# Altium project Soldeerbout_PCB.PrjPcb
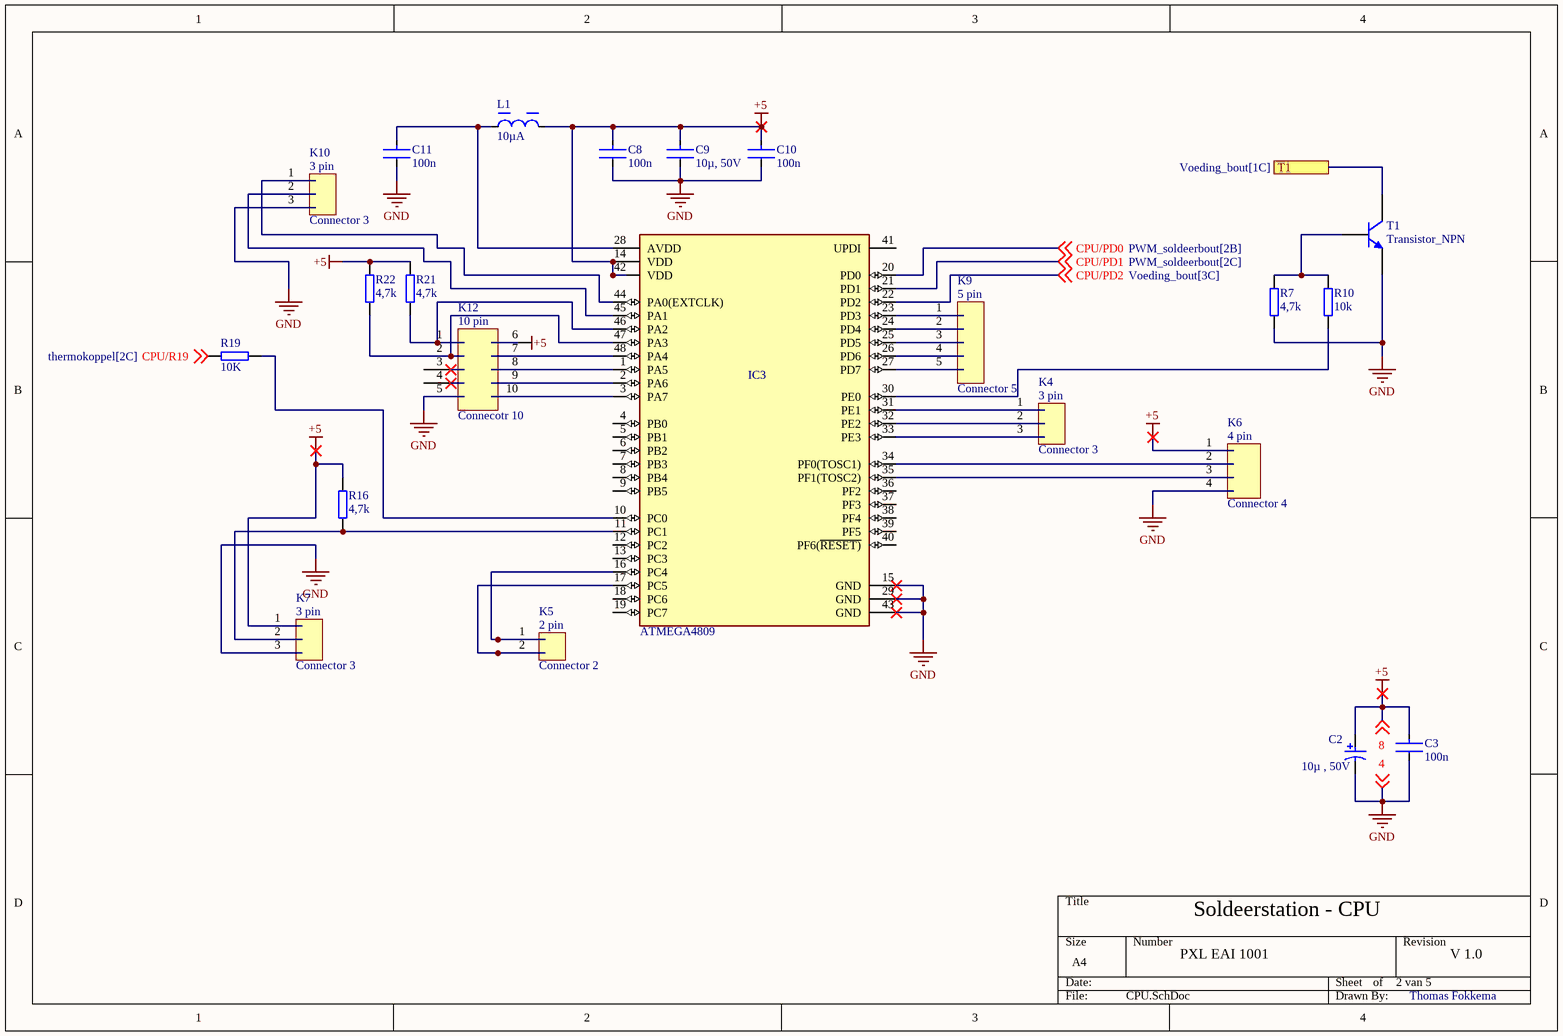
[diagram p0: CPU.SchDoc]
4 sheets, 60 parts. Net scope: flat (ports and power ports of the same name join across sheets).
Board file: PCB1.PcbDoc
Sheets:
  CPU.SchDoc
  thermokoppel.SchDoc
  Voeding_bout.SchDoc
  PWM_soldeerbout.SchDoc

## Sheet CPU.SchDoc
size A4; Address1: PXL EAI 1001; Revision: V 1.0; SheetNumber: 2; SheetTotal: 5; Sheet: 2 van 5

### Parts
C2  10µ , 50V  [CE_D8_L10]
C3  100n  [CC_0805_L]
C8  100n  [CC_0805_L]
C9  10µ, 50V  [CC_0805_L]
C10  100n  [CC_0805_L]
C11  100n  [CC_0805_L]
IC3  ATMEGA4809  [TQFP_48_M]
K4  Connector 3  [HDR1X3]
K5  Connector 2  [HDR1X2]
K6  Connector 4  [HDR1X4]
K7  Connector 3  [HDR1X3]
K9  Connector 5  [HDR1X5]
K10  Connector 3  [HDR1X3]
K12  Connecotr 10  [HDR2X5]
L1  10µA  [CC_0805_L]
R7  4,7k  [R_0805_M]
R10  10k  [R_0805_M]
R16  4,7k  [R_0805_M]
R19  10K  [R_0805_M]
R21  4,7k  [R_0805_M]
R22  4,7k  [R_0805_M]
T1  Transistor_NPN  [SOT_23]

### Ports
T1 (see Voeding_bout[1C])

### Nets
+5: C2.2 C3.1 C8.1 C9.1 C10.1 IC3.14(VDD) IC3.42(VDD) K6.1 K7.1 K12.6 L1.2 R16.2 R21.2 R22.2 ; off-sheet 8  [also labelled 8]
GND: C2.1 C3.2 C8.2 C9.2 C10.2 C11.2 IC3.15(GND) IC3.29(GND) IC3.43(GND) K6.4 K7.3 K10.3 K12.5 R7.1 T1.3(E) ; off-sheet 4  [also labelled 4]
CPU/PD0: IC3.20(PD0) ; off-sheet CPU/PD0
CPU/PD1: IC3.21(PD1) ; off-sheet CPU/PD1
CPU/PD2: IC3.22(PD2) ; off-sheet CPU/PD2
CPU/R19: R19.1 ; off-sheet CPU/R19
NetC11_1: C11.1 IC3.28(AVDD) L1.1
NetD1_2: T1.1(C) ; port T1
NetIC3_1: IC3.1(PA5) K12.8
NetIC3_2: IC3.2(PA6) K12.9
NetIC3_3: IC3.3(PA7) K12.10
NetIC3_10: IC3.10(PC0) R19.2
NetIC3_11: IC3.11(PC1) K7.2 R16.1
NetIC3_16: IC3.16(PC4) K5.1
NetIC3_17: IC3.17(PC5) K5.2
NetIC3_23: IC3.23(PD3) K9.1
NetIC3_24: IC3.24(PD4) K9.2
NetIC3_25: IC3.25(PD5) K9.3
NetIC3_26: IC3.26(PD6) K9.4
NetIC3_27: IC3.27(PD7) K9.5
NetIC3_30: IC3.30(PE0) R10.1
NetIC3_31: IC3.31(PE1) K4.1
NetIC3_32: IC3.32(PE2) K4.2
NetIC3_33: IC3.33(PE3) K4.3
NetIC3_34: IC3.34(PF0(TOSC1)) K6.2
NetIC3_35: IC3.35(PF1(TOSC2)) K6.3
NetIC3_44: IC3.44(PA0(EXTCLK)) K10.1
NetIC3_45: IC3.45(PA1) K10.2
NetIC3_46: IC3.46(PA2) K12.1 R21.1
NetIC3_47: IC3.47(PA3) K12.2 R22.1
NetIC3_48: IC3.48(PA4) K12.7
NetR7_2: R7.2 R10.2 T1.2(B)

Not connected (* = marked no-connect by the designer): IC3 4(PB0) 5(PB1) 6(PB2) 7(PB3) 8(PB4) 9(PB5) 12(PC2) 13(PC3) 18(PC6) 19(PC7) 36(PF2) 37(PF3) 38(PF4) 39(PF5) 40(PF6(~{RESET)}) 41(UPDI); K12 3(30)* 4(31)*

### Notes on the sheet
- Soldeerstation - CPU
- Thomas Fokkema
- (in symbol Connecotr 10) 10 pin
- (in symbol Connector 2) 2 pin
- (in symbol Connector 3) 3 pin
- (in symbol Connector 4) 4 pin
- (in symbol Connector 5) 5 pin

### Library data of the parts
C2 = Capacitor_Electrolytic: Manufacturer: Panasonic; Voltage Rating: 25 V; ComponentLink2URL: http://industrial.panasonic.com/cdbs/www-data/pdf/RDE0000/ABA0000C1181.pdf; Height: 10.2 mm; Max Operating Temperature: 105 degC; PackageReference: EEE-FK1E221P; ComponentLink1Description: Manufacturer URL; ComponentLink1URL: http://www.panasonic.com/; Mount: Surface Mount; REACH SVHC: No SVHC; Min Operating Temperature: -55 degC; ComponentLink2Description: Datasheet; DatasheetVersion: 03/2016; Length: 10.2 mm; RoHSCompliant: true; Packaging: Tape and Reel; Package Quantity: 500; Lead Pitch: 3.1 mm; Pins: 2; PackageDescription: 2-Pin Electrolytic Aluminum Capacitor, Body 8.3 x 8.3 mm; Mounting Technology: Surface Mount
C3 C8 C10 C11 = Capacitor_Ceramic: Manufacturer: KEMET; Manufacturer Part Number: C0805C224K5RACTU; Value: 0.22 μF; Temperature Characteristic: X7R; Temperature Coefficient: 30ppm/°C; Tolerance: 0.1; Voltage Rating: 50 V; ComponentLink2URL: https://content.kemet.com/datasheets/KEM_C1003_C0G_SMD.pdf; Device Class L3: Ceramic Capacitors; Lead Free: Yes; Temperature: -55°C to +125°C; RoHS: TRUE; Capacitance: 0.22 μF; Automotive: No; Material: Ceramic; Octopart: https://octopart.com/c0805c224k5ractu-kemet-144670; Temperature Range Low: -55°C; Height: 0.88mm; Device Class L1: Passive Components; Digikey Description: CAP CER 0.22UF 50V X7R 0805; ComponentLink2Description: Datasheet; Mouser Description: CAP CER 0.22UF 50V X7R 0805; Category: Cap; Ipc Land Pattern Name: CAPC200125X78; Temperature Range High: +125°C; Package: C0805C-DN; Device Class L2: Capacitors
C9 = Capacitor_Ceramic: Manufacturer: KEMET; Manufacturer Part Number: C0805C224K5RACTU; Value: 0.22 μF; Temperature Characteristic: X7R; Temperature Coefficient: 30ppm/°C; Tolerance: 0.1; ComponentLink2URL: https://content.kemet.com/datasheets/KEM_C1003_C0G_SMD.pdf; Device Class L3: Ceramic Capacitors; Lead Free: Yes; Temperature: -55°C to +125°C; RoHS: TRUE; Capacitance: 0.22 μF; Automotive: No; Material: Ceramic; Octopart: https://octopart.com/c0805c224k5ractu-kemet-144670; Temperature Range Low: -55°C; Height: 0.88mm; Device Class L1: Passive Components; Digikey Description: CAP CER 0.22UF 50V X7R 0805; ComponentLink2Description: Datasheet; Mouser Description: CAP CER 0.22UF 50V X7R 0805; Category: Cap; Ipc Land Pattern Name: CAPC200125X78; Temperature Range High: +125°C; Package: C0805C-DN; Device Class L2: Capacitors; Voltage Rating: 50 V
IC3 = ATMEGA4809: Peripherals: Brown-out Detect/Reset; Number of I/Os: 41; Core Architecture: AVR; Memory Size: 48KB; Interface: I2C; Oscillator Type: Internal; Memory Type: FLASH; Series: megaAVR® 0, Functional Safety (FuSa); Min Operating Temperature: -40°C; Mount: Surface Mount; Case/Package: TQFP; RoHS Compliant: Yes; Max Operating Temperature: 85°C
L1 = Choke: Tolerance: 20%; Shielding: Shielded; Saturation Current: 10A; Test Frequency: 100kHz; RMS Current (Irms): 8.5A; Inductance: 10uH; Series Resistance: 14.1R; DC Resistance (DCR): 14.1mR; Self Resonant Frequency: 18MHz; Ratings: AEC-Q200; Width: 12.8mm; Series: WE-HCI; Length: 0.512inch; Mount: Surface Mount; Resistor Type: Wirewound; RoHS Compliant: Yes; Package Quantity: 1; Min Operating Temperature: -40°C; Inductance Tolerance: 20%; Termination: SMD/SMT; Max DC Current: 8.5A; Height - Seated (Max): 0.197inch; Case/Package: 1350; Current Rating: 8.5A; Max Operating Temperature: 155°C; Packaging: Tape and Reel; Height: 4.7mm
R7 R10 R16 R19 R21 R22 = Resistor: Manufacturer: Vishay Dale; Part Number: CRCW08050000Z0EA
T1 = Transistor_NPN: Manufacturer: On Semiconductor; PartNumber: BC547C; IC Continuous (A): 0.1; fT Min (MHz): 150; Packing: Bulk Box; Polarity: NPN; Mounting Technology: Through Hole; ComponentLink1URL: http://www.onsemi.com/; ComponentLink1Description: Manufacturer URL; ComponentLink3URL: http://www.onsemi.cn/pub_link/Collateral/2N6426-D.PDF; DatasheetVersion: Rev. 7; PackageVersion: Rev. AM; RoHS: FALSE; ComponentLink2URL: http://www.onsemi.com/pub_link/Collateral/BC546-D.PDF; ComponentLink3Description: Package Specification; PackageDescription: 3-Pin Transistor Outline, Body 4.825 x 3.685 mm, Pitch 1.27 mm; PackageReference: TO-92-3-29-11_AM_SL; ComponentLink2Description: Datasheet

## Sheet thermokoppel.SchDoc: soldeerstation
size A4; Date: 24/02/2023; Author: Samy Warnants; CompanyName: pxl; DrawnBy: Samy warnants; Engineer: Samy Warnants; Organization: elektronica; DocumentNumber: 1; Revision: v1.0; SheetNumber: 2; SheetTotal: 4; Time: 9:51
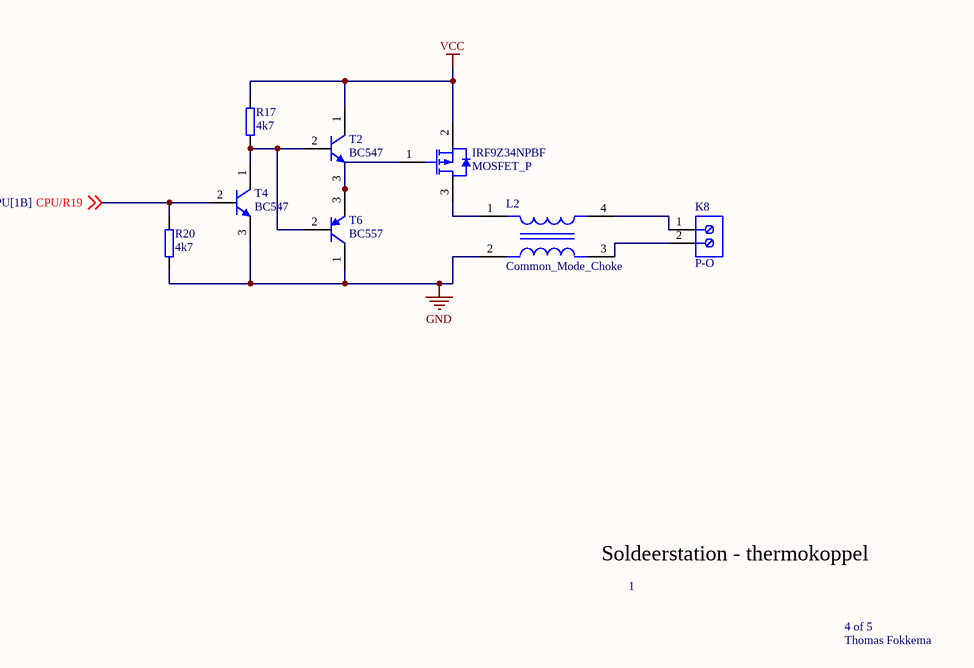
[diagram p1: thermokoppel.SchDoc]

### Parts
IRF9Z34NPBF  MOSFET_P  [TO_252]
K8  P-O  [PHOE-1714955_V]
L2  Common_Mode_Choke  [2545]
R17  4k7  [R_0805_M]
R20  4k7  [R_0805_M]
T2  BC547  [SOT_23]
T4  BC547  [SOT_23]
T6  BC557  [SOT_23]

### Nets
GND: L2.2 R20.1 T4.3(E) T6.1(C)
VCC: IRF9Z34NPBF.2(SOURCE) R17.2 T2.1(C)
CPU/R19: R20.2 T4.2(B) ; off-sheet CPU/R19
NetIRF9Z34NPBF_1: IRF9Z34NPBF.1(GATE) T2.3(E) T6.3(E)
NetIRF9Z34NPBF_3: IRF9Z34NPBF.3(DRAIN) L2.1
NetK8_1: K8.1 L2.4
NetK8_2: K8.2 L2.3
NetR17_1: R17.1 T2.2(B) T4.1(C) T6.2(B)

### Notes on the sheet
- Soldeerstation - thermokoppel
- 1
- 4 of 5
- Thomas Fokkema

### Library data of the parts
IRF9Z34NPBF = MOSFET_P: Manufacturer: Fairchild Semiconductor; Reel Quantity: 3000; Drain Source Voltage Vds: 20V; Power Dissipation Pd: 500mW; On Resistance Rds(on): 52mohm; Full Power Rating Temperature: 25°C; Voltage Vgs Max: -800mV; Pulse Current Idm: 10A; Rds(on) Test Voltage Vgs: -4.5V; External Depth: 2.5mm; Transistor Case Style: SOT-23; No. of Pins: 3; Continuous Drain Current Id: 2.4A; Voltage Vds Typ: -20V; Voltage Vgs th Max: -1.5V; Transistor Polarity: PChannel; Package Version: Rev. 3, 05/2015; External Width: 3.05mm; External Length / Height: 1.12mm; SMD Marking: 304P; SVHC: NoSVHC(19-Dec-2012); Termination Type: SMD; Datasheet URL: https://www.fairchildsemi.com/datasheets/FD/FDN304P.pdf; Tape Width: 8mm; Mounting Technology: SurfaceMount; Voltage Vgs Rds on Measurement: -4.5V; Operating Temperature Range: -55°Cto+150°C; Current Temperature: 25°C; Operating Temperature Min: -55°C; Threshold Voltage Vgs Typ: -800mV; Package / Case: SOT-23; Manufacturer URL: https://www.fairchildsemi.com/; Voltage Vds: 20V; Datasheet Version: Rev. C, 01/2001; Operating Temperature Max: 150°C; Package Description: 3-Pin Small Outline Transistor, Body 2.92 x 1.4 mm, Pitch 0.95 mm; Current Id Max: 2.4A; Package URL: https://www.fairchildsemi.com/package-drawings/MA/MA03B.pdf; Package Reference: SSOT3L
K8 = CMP-2000-05797-1: PC Terminal Block, Pitch 6.35 mm, 1 x 2 Position, Height 21.5 mm, Tail Lenght 5.1 mm, RoHS, Bulk; Manufacturer: Phoenix Contact; Package Description: PC Terminal Block, Pitch 6.35 mm, 1 x 2 Position, Height 21.5 mm, Tail Lenght 5.1 mm; Datasheet URL: http://media.digikey.com/pdf/Data%20Sheets/Phoenix%20Contact%20PDFs/1714955.pdf; Package Reference: 1714955; Manufacturer URL: http://www.phoenixcontact.com/; Datasheet Version: 02/2010; Mounting Technology: ThroughHole
L2 = Common_Mode_Choke: Max Current Rating: 2A; Number of Lines: 2; Impedance: 900R; Element Configuration: Dual; Insulation Resistance: 10MR; Test Frequency: 100MHz; DC Resistance (DCR): 60mR; Voltage Rating (DC): 50V; Current Rating: 2.3A; Number of Pins: 4; DC Current: 2A; Mount: Surface Mount; Current: 2A; REACH SVHC: No SVHC; Width: 4.5mm; Case/Package: 1808; Voltage Rating: 50V; Package Quantity: 1; Height: 2mm; Max DC Current: 2A; Packaging: Tape and Reel; Max Operating Temperature: 85°C; Lead Free: Lead Free; Length: 0.185inch; Series: ACM; Radiation Hardening: No; Max Voltage Rating (DC): 50V; Termination: Flat; Depth: 4.7mm; RoHS Compliant: Yes; DC Resistance-Max: 60mR; Min Operating Temperature: -40°C
R17 R20 = Resistor: as R7 on sheet CPU
T2 T4 = Transistor_NPN: as T1 on sheet CPU; Mounting Technology: Through Hole; ComponentLink1URL: http://www.onsemi.com/; ComponentLink1Description: Manufacturer URL; ComponentLink3URL: http://www.onsemi.cn/pub_link/Collateral/2N6426-D.PDF; DatasheetVersion: Rev. 7; PackageVersion: Rev. AM; RoHS: FALSE; ComponentLink2URL: http://www.onsemi.com/pub_link/Collateral/BC546-D.PDF; ComponentLink3Description: Package Specification; PackageDescription: 3-Pin Transistor Outline, Body 4.825 x 3.685 mm, Pitch 1.27 mm; PackageReference: TO-92-3-29-11_AM_SL; ComponentLink2Description: Datasheet
T6 = Transistor_PNP: Manufacturer: On Semiconductor; PartNumber: BC557C; Polarity: PNP; IC Continuous (A): -0.1; Packing: Bulk Box; PackageVersion: Rev. AM; RoHS: FALSE; PackageDescription: 3-Pin Transistor Outline, Body 4.825 x 3.685 mm, Pitch 1.27 mm; ComponentLink2Description: Datasheet; DatasheetVersion: Rev. 3; ComponentLink3Description: Package Specification; Mounting Technology: Through Hole; ComponentLink2URL: http://www.onsemi.com/pub_link/Collateral/BC556B-D.PDF; ComponentLink1URL: http://www.onsemi.com/; ComponentLink1Description: Manufacturer URL; ComponentLink3URL: http://www.onsemi.cn/pub_link/Collateral/2N6426-D.PDF; PackageReference: TO-92-3-29-11_AM_SL

## Sheet Voeding_bout.SchDoc
size A4; SheetNumber: 3; SheetTotal: 4
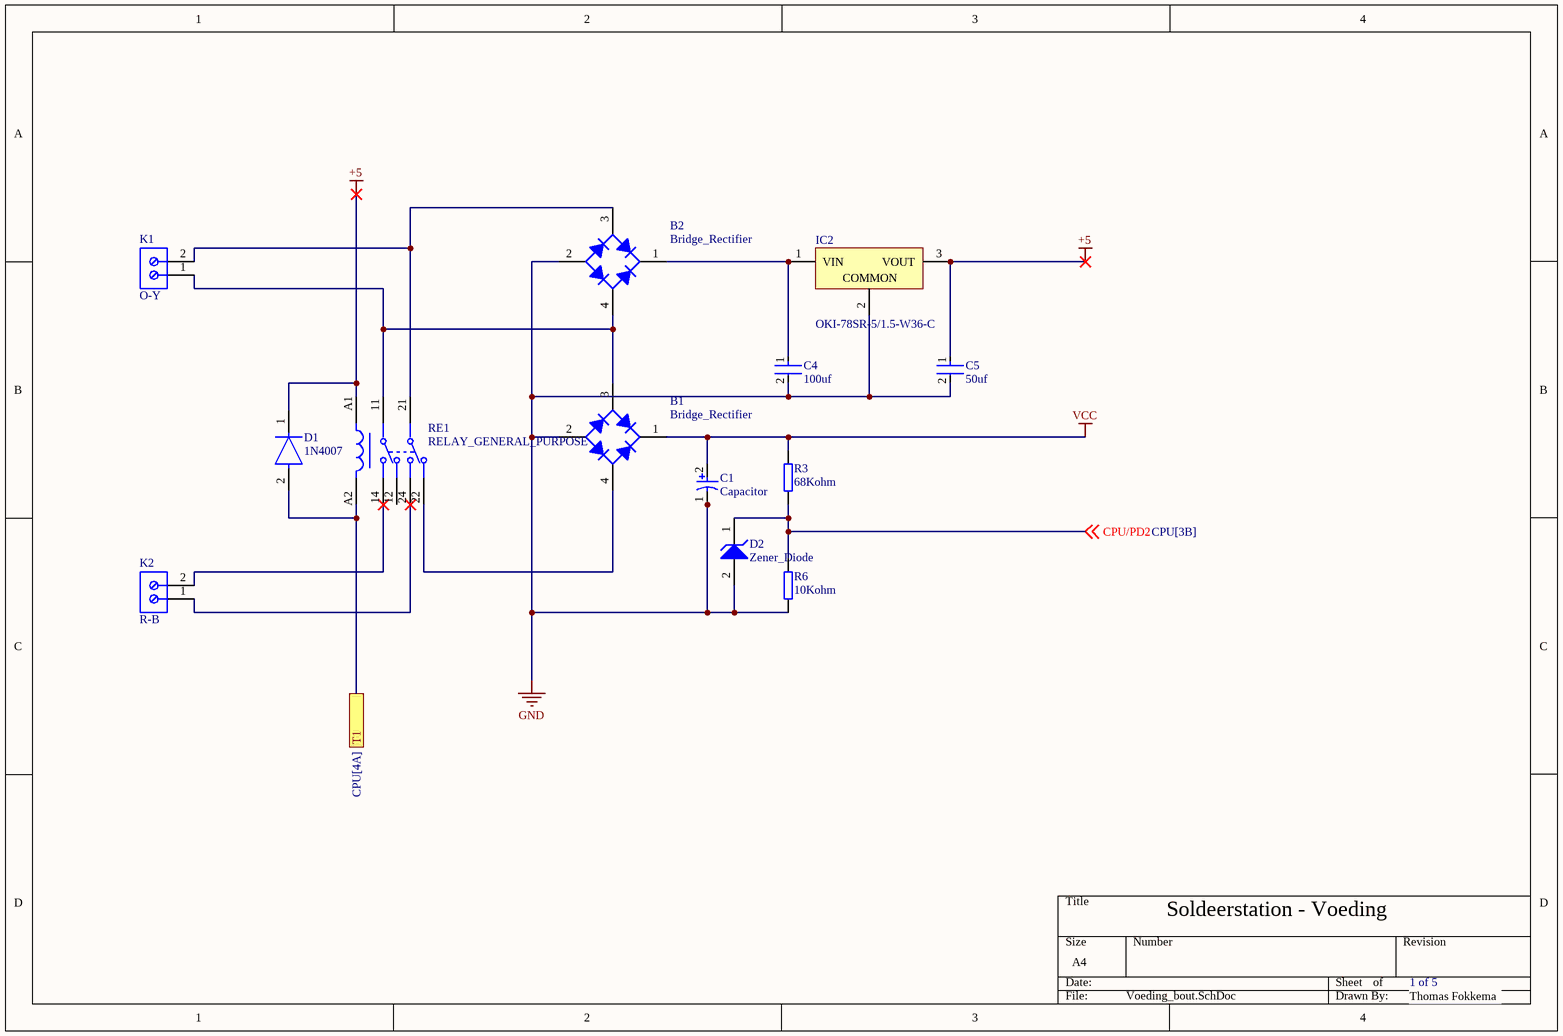
[diagram p2: Voeding_bout.SchDoc]

### Parts
B1  Bridge_Rectifier  [ttf]
B2  Bridge_Rectifier  [ttf]
C1  Capacitor  [CE_D25_L25_plugin]
C4  100uf  [CC_0805_L]
C5  50uf  [CC_0805_L]
D1  1N4007  [SOD-123FL]
D2  Zener_Diode  [SOD-123FL]
IC2  OKI-78SR-5/1.5-W36-C  [OKI78SR515W36C]
K1  O-Y  [PHOE-1714955_V]
K2  R-B  [PHOE-1714955_V]
R3  68Kohm  [R_0805_M]
R6  10Kohm  [R_0805_M]
RE1  RELAY_GENERAL_PURPOSE  [RT42]

### Ports
T1 (see CPU[4A])

### Nets
+5: C5.1 D1.1(C) IC2.3(VOUT) RE1.A1
GND: B1.2(A) B2.2(A) C1.1 C4.2 C5.2 D2.2(A) IC2.2(COMMON) R6.1
VCC: B1.1(K) C1.2 R3.1
CPU/PD2: D2.1(K) R3.2 R6.2 ; off-sheet CPU/PD2
NetB1_3: B1.3(C) B2.4(C) K1.1 RE1.11
NetB1_4: B1.4(C) RE1.22
NetB2_1: B2.1(K) C4.1 IC2.1(VIN)
NetB2_3: B2.3(C) K1.2 RE1.21
NetD1_2: D1.2(A) RE1.A2 ; port T1
NetK2_1: K2.1 RE1.24
NetK2_2: K2.2 RE1.14

Not connected (* = marked no-connect by the designer): RE1 12

### Notes on the sheet
- Soldeerstation - Voeding
- 1 of 5
- Thomas Fokkema

### Library data of the parts
B1 B2 = Bridge_Rectifier: Manufacturer: Diodes Inc; Average Rectified Current-Max: 0.8A; Reverse Voltage-Max [Vrrm]: 600V; Forward Voltage: 1V; Peak Current-Max: 30A; Reverse Current-Max: 5µA; Package Version: 05/2016; Package URL: http://www.diodes.com/_files/packages/MiniDIP.pdf; Datasheet Version: Rev. 13-2, 12/2010; Datasheet URL: http://www.diodes.com/_files/datasheets/ds17003.pdf; Mounting Technology: SurfaceMount; Manufacturer URL: http://www.diodes.com/; Package Reference: MiniDIP-4; Package Description: 4-Pin Small Outline Integrated Circuit, Body 4.7 x 3.8 mm, Pitch 2.5 mm
C4 C5 = Capacitor_Ceramic: as C3 on sheet CPU; ComponentLink2URL: https://content.kemet.com/datasheets/KEM_C1003_C0G_SMD.pdf; Device Class L3: Ceramic Capacitors; Lead Free: Yes; Temperature: -55°C to +125°C; RoHS: TRUE; Capacitance: 0.22 μF; Automotive: No; Material: Ceramic; Octopart: https://octopart.com/c0805c224k5ractu-kemet-144670; Temperature Range Low: -55°C; Height: 0.88mm; Device Class L1: Passive Components; Digikey Description: CAP CER 0.22UF 50V X7R 0805; ComponentLink2Description: Datasheet; Mouser Description: CAP CER 0.22UF 50V X7R 0805; Category: Cap; Ipc Land Pattern Name: CAPC200125X78; Temperature Range High: +125°C; Package: C0805C-DN; Device Class L2: Capacitors
D1 = Diode: Manufacturer: Diotec; Max Surge Forward Current: 27A; Forward Current: 1A; Max Junction Temp: +175°C; Reverse Voltage: 1000V; Value: 15pF; Peak Reverse Current: 5uA; Category: Diode; Temperature Range Low: -50°C; Automotive: No; Temperature: -50°C to +175°C; Lead Free: Yes; ComponentLink2Description: Datasheet; Max Repetitive Reverse Voltage: 1000V; ComponentLink2URL: https://datasheet.octopart.com/1N4007-Diotec-datasheet-62346875.pdf; Manufacturer Part Number: 1N4007; Device Class L3: Rectifier Diodes; Height: 2.8mm; Octopart: https://octopart.com/1n4007-diotec-4040411; Package: 1N4007; Temperature Range High: +175°C; Device Class L1: Discrete Semiconductors; Device Class L2: Diodes; RoHS: TRUE; Capacitance: 15pF; Ipc Land Pattern Name: DIOAD888W100L520D280
D2 = Zener_Diode: Manufacturer: On Semiconductor; PartNumber: 1SMB5920BT3G; Packing: Tape and Reel; VZ Typ (V): 6.2; PackageDescription: 2-Pin Small Molded Package, J-Bend Lead, Body 4.33 x 3.625 mm; Mounting Technology: Surface Mount; PackageVersion: Rev. H, 05/2011; ComponentLink1Description: Manufacturer URL; RoHS: Pb-Free; DatasheetVersion: Rev. 8; ComponentLink2Description: Datasheet; ComponentLink2URL: http://www.onsemi.com/pub_link/Collateral/1SMB5913BT3-D.PDF; ComponentLink1URL: http://www.onsemi.com/; ComponentLink3Description: Package Specification; PackageReference: SMB-2-403A-03_H; ComponentLink3URL: http://www.onsemi.com/pub_link/Collateral/1SMB5913BT3-D.PDF
IC2 = OKI-78SR-5/1.5-W36-C: Non-Isolated DC/DC Converter, 7.5 W, 7 to 36 V, 1.5 A, -40 to 85 degC, 3-Pin THD, RoHS; Manufacturer: Murata; Current - Output (Max): 1.5A; Power (Watts) - Max: 8W; Efficiency: 90.5%; Voltage - Input (Min): 7V; Voltage - Input (Max): 36V; Voltage - Output 1: 5V; Number of Outputs: 1; Package / Case: 3-SIPModule; Features: SCP; Type: LinearRegulatorReplacement; Size / Dimension: 0.41"Lx0.30"Wx0.65"H(10.4mmx7.6mmx16.5mm); Datasheet URL: https://datasheet.ciiva.com/8006/1790439-8006672.pdf; Datasheet Version: Oct-13; Power (Watts) - Manufacture Series: 8W; Voltage - Output 2: -; Series: Okami™OKI-78SR; Family: DCDCConverters; Manufacturer URL: http://www.murata.com/; Category: PowerSupplies-BoardMount; Voltage - Isolation: -; Packaging: Tube; Applications: ITE(Commercial); Mounting Type: ThroughHole; Voltage - Output 3: -; Operating Temperature: -40degC~85degC
K1 K2 = CMP-2000-05797-1: as K8 on sheet thermokoppel; Package Description: PC Terminal Block, Pitch 6.35 mm, 1 x 2 Position, Height 21.5 mm, Tail Lenght 5.1 mm; Datasheet URL: http://media.digikey.com/pdf/Data%20Sheets/Phoenix%20Contact%20PDFs/1714955.pdf; Package Reference: 1714955; Manufacturer URL: http://www.phoenixcontact.com/; Datasheet Version: 02/2010; Mounting Technology: ThroughHole
R3 R6 = Resistor: as R7 on sheet CPU
RE1 = RELAY_GENERAL_PURPOSE: Manufacturer Part Number: RT424005; Manufacturer: TE Connectivity; Coil Power: 403mW; Throw Configuration: DPDT; Coil Voltage: 5V; Number Of Contacts: 2; Coil Resistance: 62Ω; Current Rating: 8A; Coil Type: Non-Latching; Category: Relay; Octopart: https://octopart.com/5-1393243-9-te+connectivity-41835766; Device Class L3: Power Relays; ComponentLink2URL: https://www.te.com/commerce/DocumentDelivery/DDEController?Action=showdoc&DocId=Data+Sheet%7FRT2%7F1014%7Fpdf%7FEnglish%7FENG_DS_RT2_1014.pdf%7F5-1393243-9; Ambient Temperature Range High: +85°C; ComponentLink2Description: Datasheet; Digikey Description: RELAY GENERAL PURPOSE DPDT 8A 5V; Package: RT424005; Automotive: No; Device Class L1: Electromechanical; Height: 15.7mm; Device Class L2: Relays; Ambient Temperature Range Low: -40°C; Mouser Description: General Purpose Relay, Rt2 Series, Power, Non Latching, Dpdt, 5 Vdc, 8 A Rohs Compliant: Yes; Lead Free: Yes; RoHS: TRUE

## Sheet PWM_soldeerbout.SchDoc
size A4; Address1: PXL EAI 1001; Revision: V 1.0; SheetNumber: 4; SheetTotal: 4
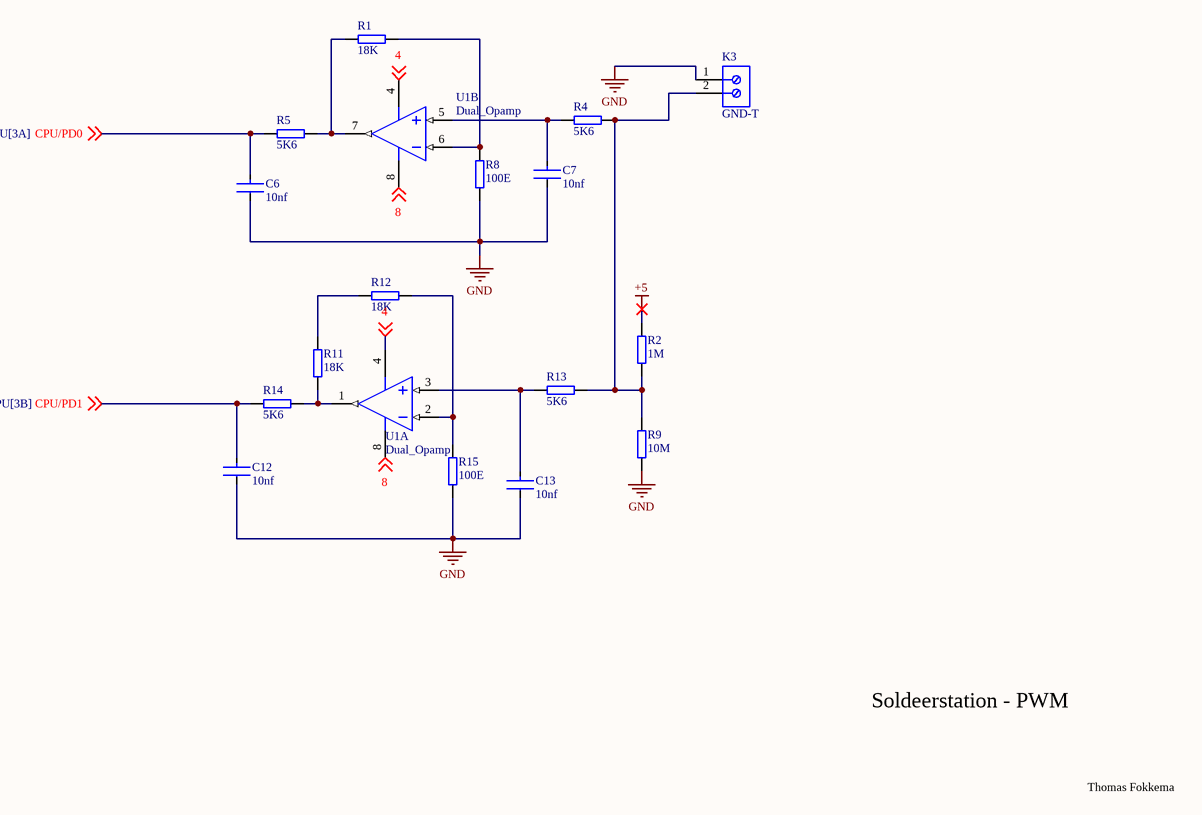
[diagram p3: PWM_soldeerbout.SchDoc]

### Parts
C6  10nf  [CC_0805_L]
C7  10nf  [CC_0805_L]
C12  10nf  [CC_0805_L]
C13  10nf  [CC_0805_L]
K3  GND-T  [PHOE-1714955_V]
R1  18K  [R_0805_M]
R2  1M  [R_0805_M]
R4  5K6  [R_0805_M]
R5  5K6  [R_0805_M]
R8  100E  [R_0805_M]
R9  10M  [R_0805_M]
R11  18K  [R_0805_M]
R12  18K  [R_0805_M]
R13  5K6  [R_0805_M]
R14  5K6  [R_0805_M]
R15  100E  [R_0805_M]
U1  Dual_Opamp  [MSOP_8_M]  (parts A,B of 2)

### Nets
+5: R2.2 U1.8(VDD) ; off-sheet 8  [also labelled 8]
GND: C6.2 C7.2 C12.2 C13.2 K3.1 R8.1 R9.1 R15.1 U1.4(VSS) ; off-sheet 4  [also labelled 4]
CPU/PD0: C6.1 R5.1 ; off-sheet CPU/PD0
CPU/PD1: C12.1 R14.1 ; off-sheet CPU/PD1
NetC7_1: C7.1 R4.1 U1.5(VINB+)
NetC13_1: C13.1 R13.1 U1.3(VINA+)
NetK3_2: K3.2 R2.1 R4.2 R9.2 R13.2
NetR1_1: R1.1 R5.2 U1.7(VOUTB)
NetR1_2: R1.2 R8.2 U1.6(VINB-)
NetR11_1: R11.1 R14.2 U1.1(VOUTA)
NetR11_2: R11.2 R12.1
NetR12_2: R12.2 R15.2 U1.2(VINA-)

### Notes on the sheet
- Soldeerstation - PWM
- Thomas Fokkema

### Library data of the parts
C6 C7 C12 C13 = Capacitor_Ceramic: as C3 on sheet CPU; ComponentLink2URL: https://content.kemet.com/datasheets/KEM_C1003_C0G_SMD.pdf; Device Class L3: Ceramic Capacitors; Lead Free: Yes; Temperature: -55°C to +125°C; RoHS: TRUE; Capacitance: 0.22 μF; Automotive: No; Material: Ceramic; Octopart: https://octopart.com/c0805c224k5ractu-kemet-144670; Temperature Range Low: -55°C; Height: 0.88mm; Device Class L1: Passive Components; Digikey Description: CAP CER 0.22UF 50V X7R 0805; ComponentLink2Description: Datasheet; Mouser Description: CAP CER 0.22UF 50V X7R 0805; Category: Cap; Ipc Land Pattern Name: CAPC200125X78; Temperature Range High: +125°C; Package: C0805C-DN; Device Class L2: Capacitors
K3 = CMP-2000-05797-1: as K8 on sheet thermokoppel; Package Description: PC Terminal Block, Pitch 6.35 mm, 1 x 2 Position, Height 21.5 mm, Tail Lenght 5.1 mm; Datasheet URL: http://media.digikey.com/pdf/Data%20Sheets/Phoenix%20Contact%20PDFs/1714955.pdf; Package Reference: 1714955; Manufacturer URL: http://www.phoenixcontact.com/; Datasheet Version: 02/2010; Mounting Technology: ThroughHole
R1 R2 R4 R5 R8 R9 R11-R15 = Resistor: as R7 on sheet CPU
U1 = Dual_Opamp: Slew Rate: 0.6V/µs; Supply Current: 100uA; Power Supply Rejection Ratio (PSRR): 86dB; Input Offset Voltage (Vos): 4.5mV; Input Bias Current: 1pA; Amplifier Type: GENERAL PURPOSE; Unity Gain Bandwidth Product: 1MHz; Number of Circuits: 2; Output Current: 23mA; Operating Supply Voltage: 5.5V; Min Supply Voltage: 1.8V; Common Mode Rejection Ratio: 60dB; Voltage Gain: 112dB; Max Supply Voltage: 6V; Package Quantity: 60; REACH SVHC: No SVHC; Min Operating Temperature: -40°C; Max Operating Temperature: 125°C; Mount: Through Hole; Nominal Supply Current: 100uA; Height: 3.3mm; Length: 9.27mm; Slew Rate-Nom: 0.6V/µs; Packaging: Rail/Tube; Output Current per Channel: 23mA; Number of Amplifiers: 2; RoHS Compliant: Yes; Radiation Hardening: No; Bandwidth: 1MHz; Lead Free: Lead Free; Width: 6.35mm; Number of Channels: 2; Gain Bandwidth Product: 1MHz; Technology: CMOS; Operating Supply Current: 100uA; Number of Elements: 2; Number of Pins: 8; Input Offset Voltage-Max: 4.5mV; Case/Package: PDIP

## Nets that join several sheets
+5: CPU (14 pins), Voeding_bout (C5.1 D1.1 IC2.3 RE1.A1), PWM_soldeerbout (R2.2 U1.8)
GND: CPU (15 pins), thermokoppel (L2.2 R20.1 T4.3 T6.1), Voeding_bout (8 pins), PWM_soldeerbout (9 pins)
VCC: thermokoppel (IRF9Z34NPBF.2 R17.2 T2.1), Voeding_bout (B1.1 C1.2 R3.1)
CPU/PD0: CPU (IC3.20), PWM_soldeerbout (C6.1 R5.1)
CPU/PD1: CPU (IC3.21), PWM_soldeerbout (C12.1 R14.1)
CPU/PD2: CPU (IC3.22), Voeding_bout (D2.1 R3.2 R6.2)
CPU/R19: CPU (R19.1), thermokoppel (R20.2 T4.2)
NetD1_2: CPU (T1.1), Voeding_bout (D1.2 RE1.A2)